# EasyEDA Pro project 贴片练习PCB.epro, board PCB1
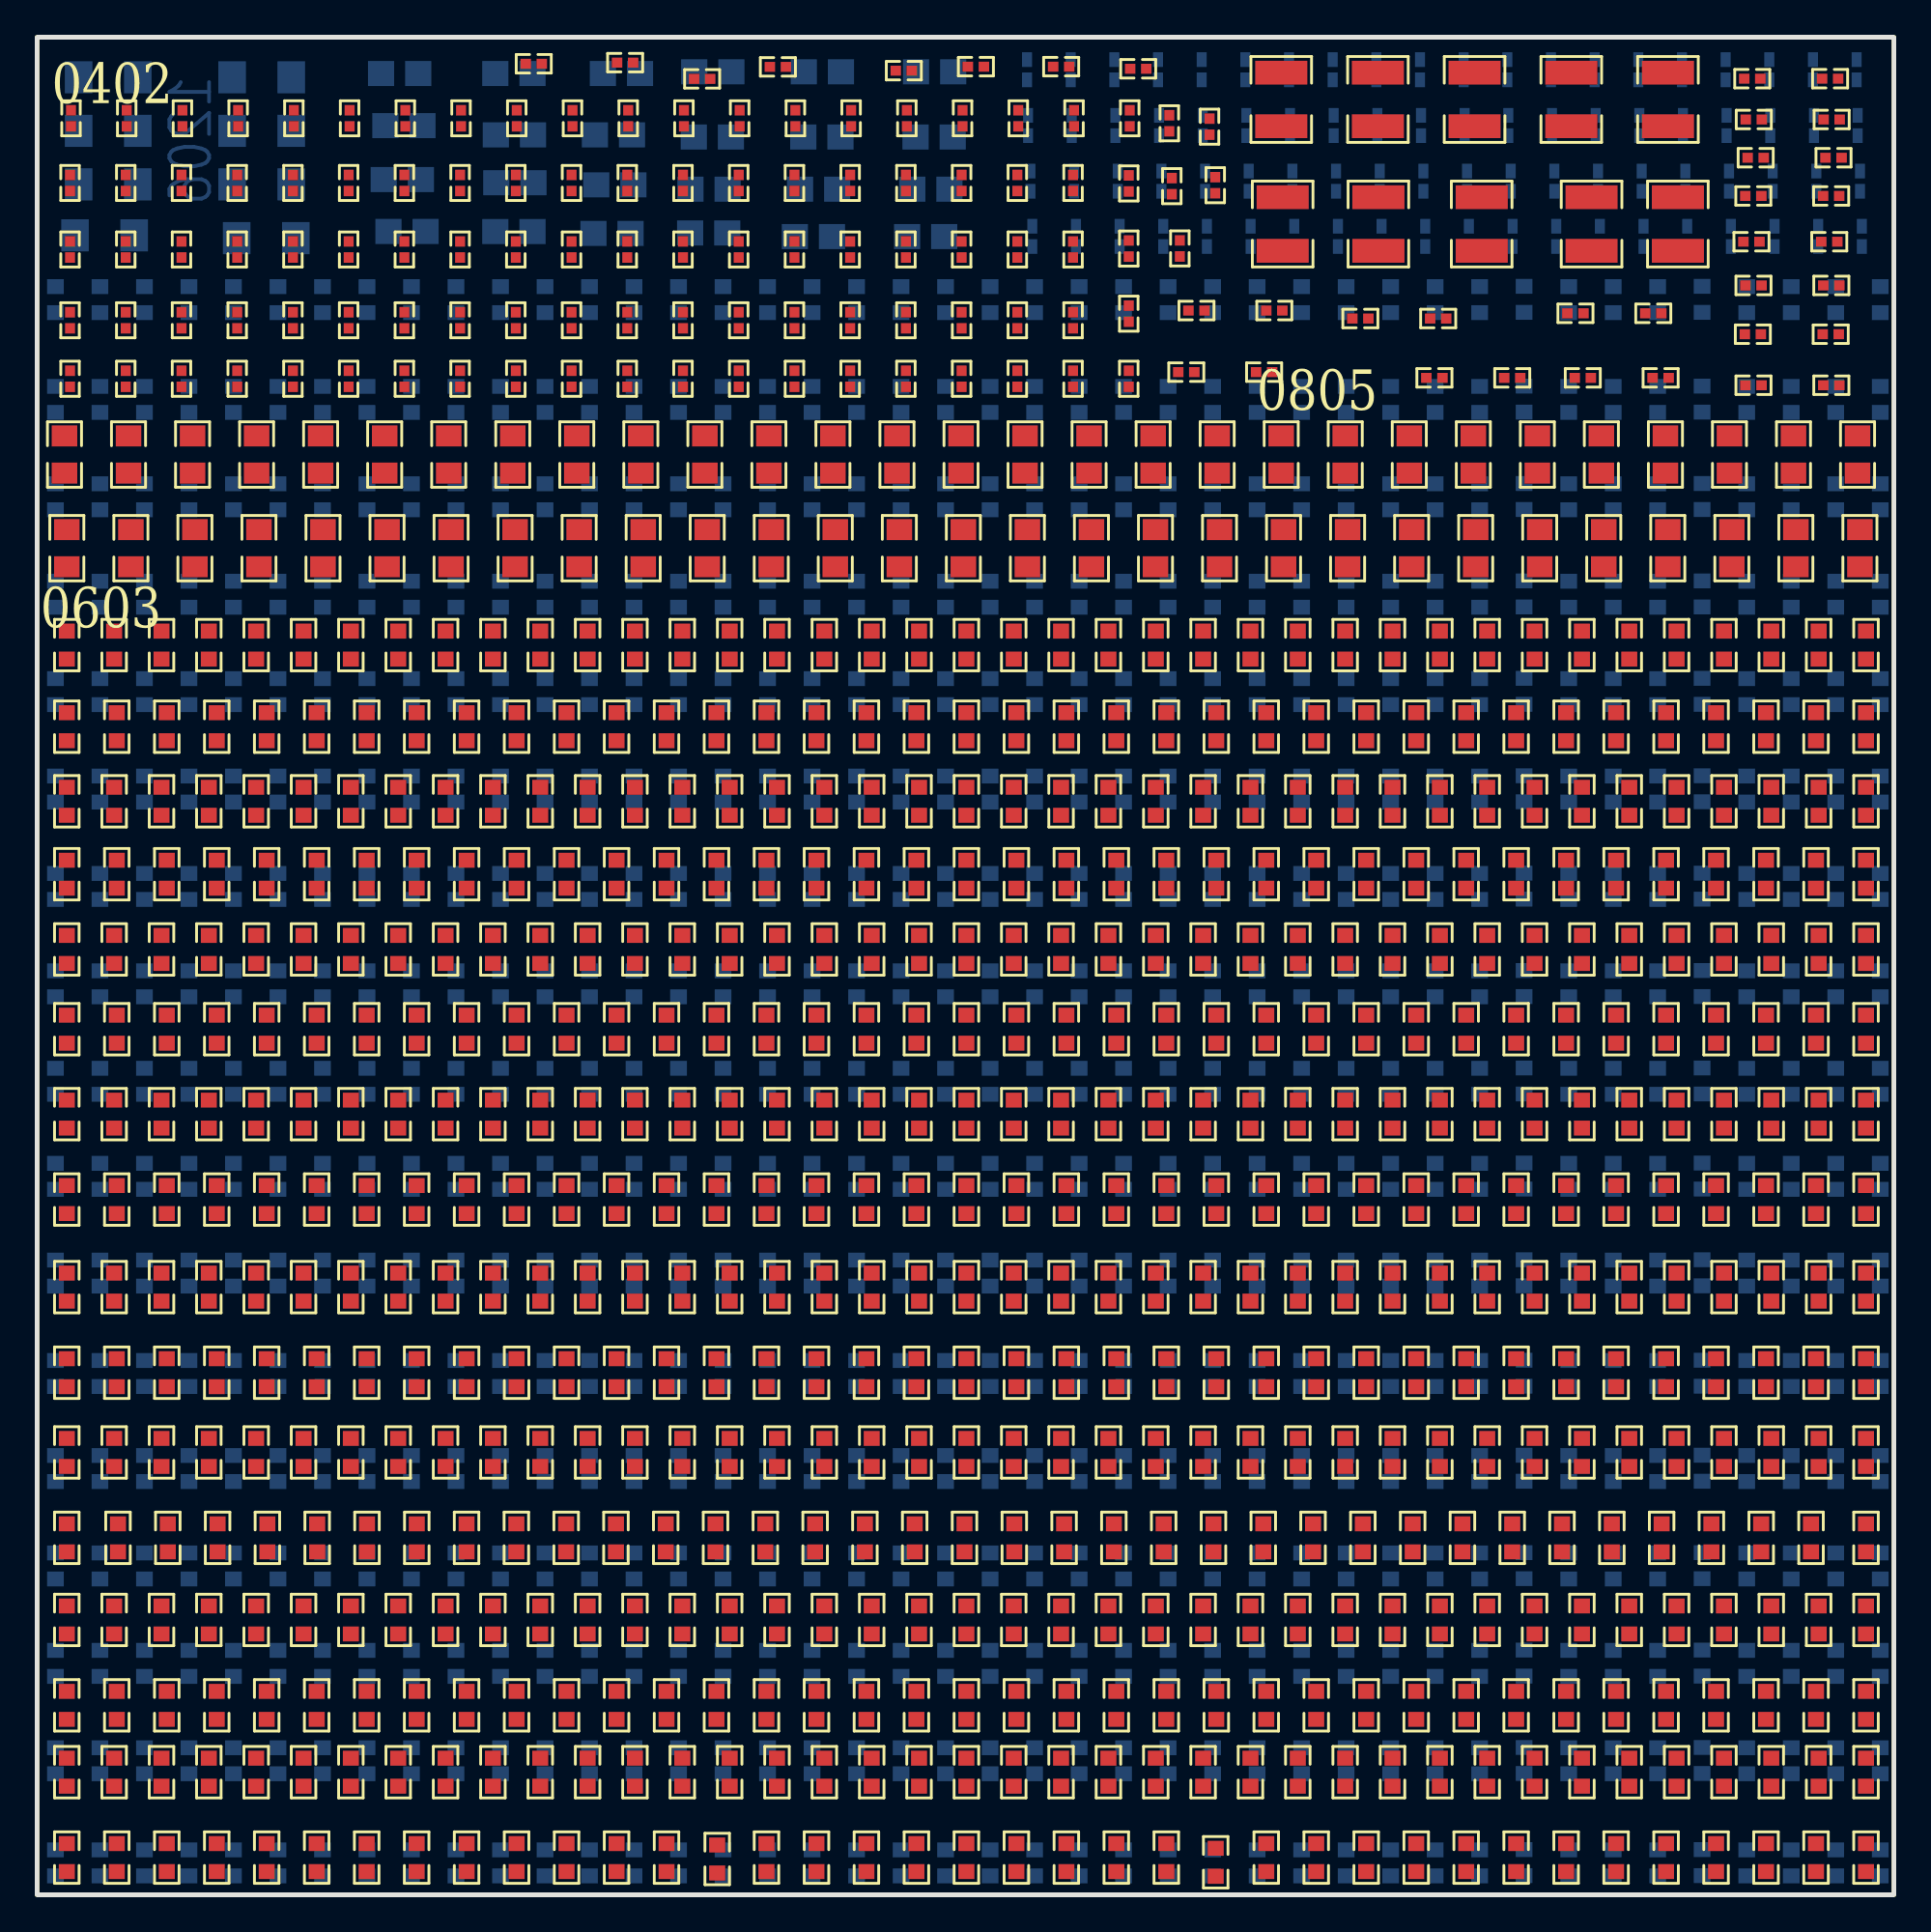
[diagram p3: board, top side]
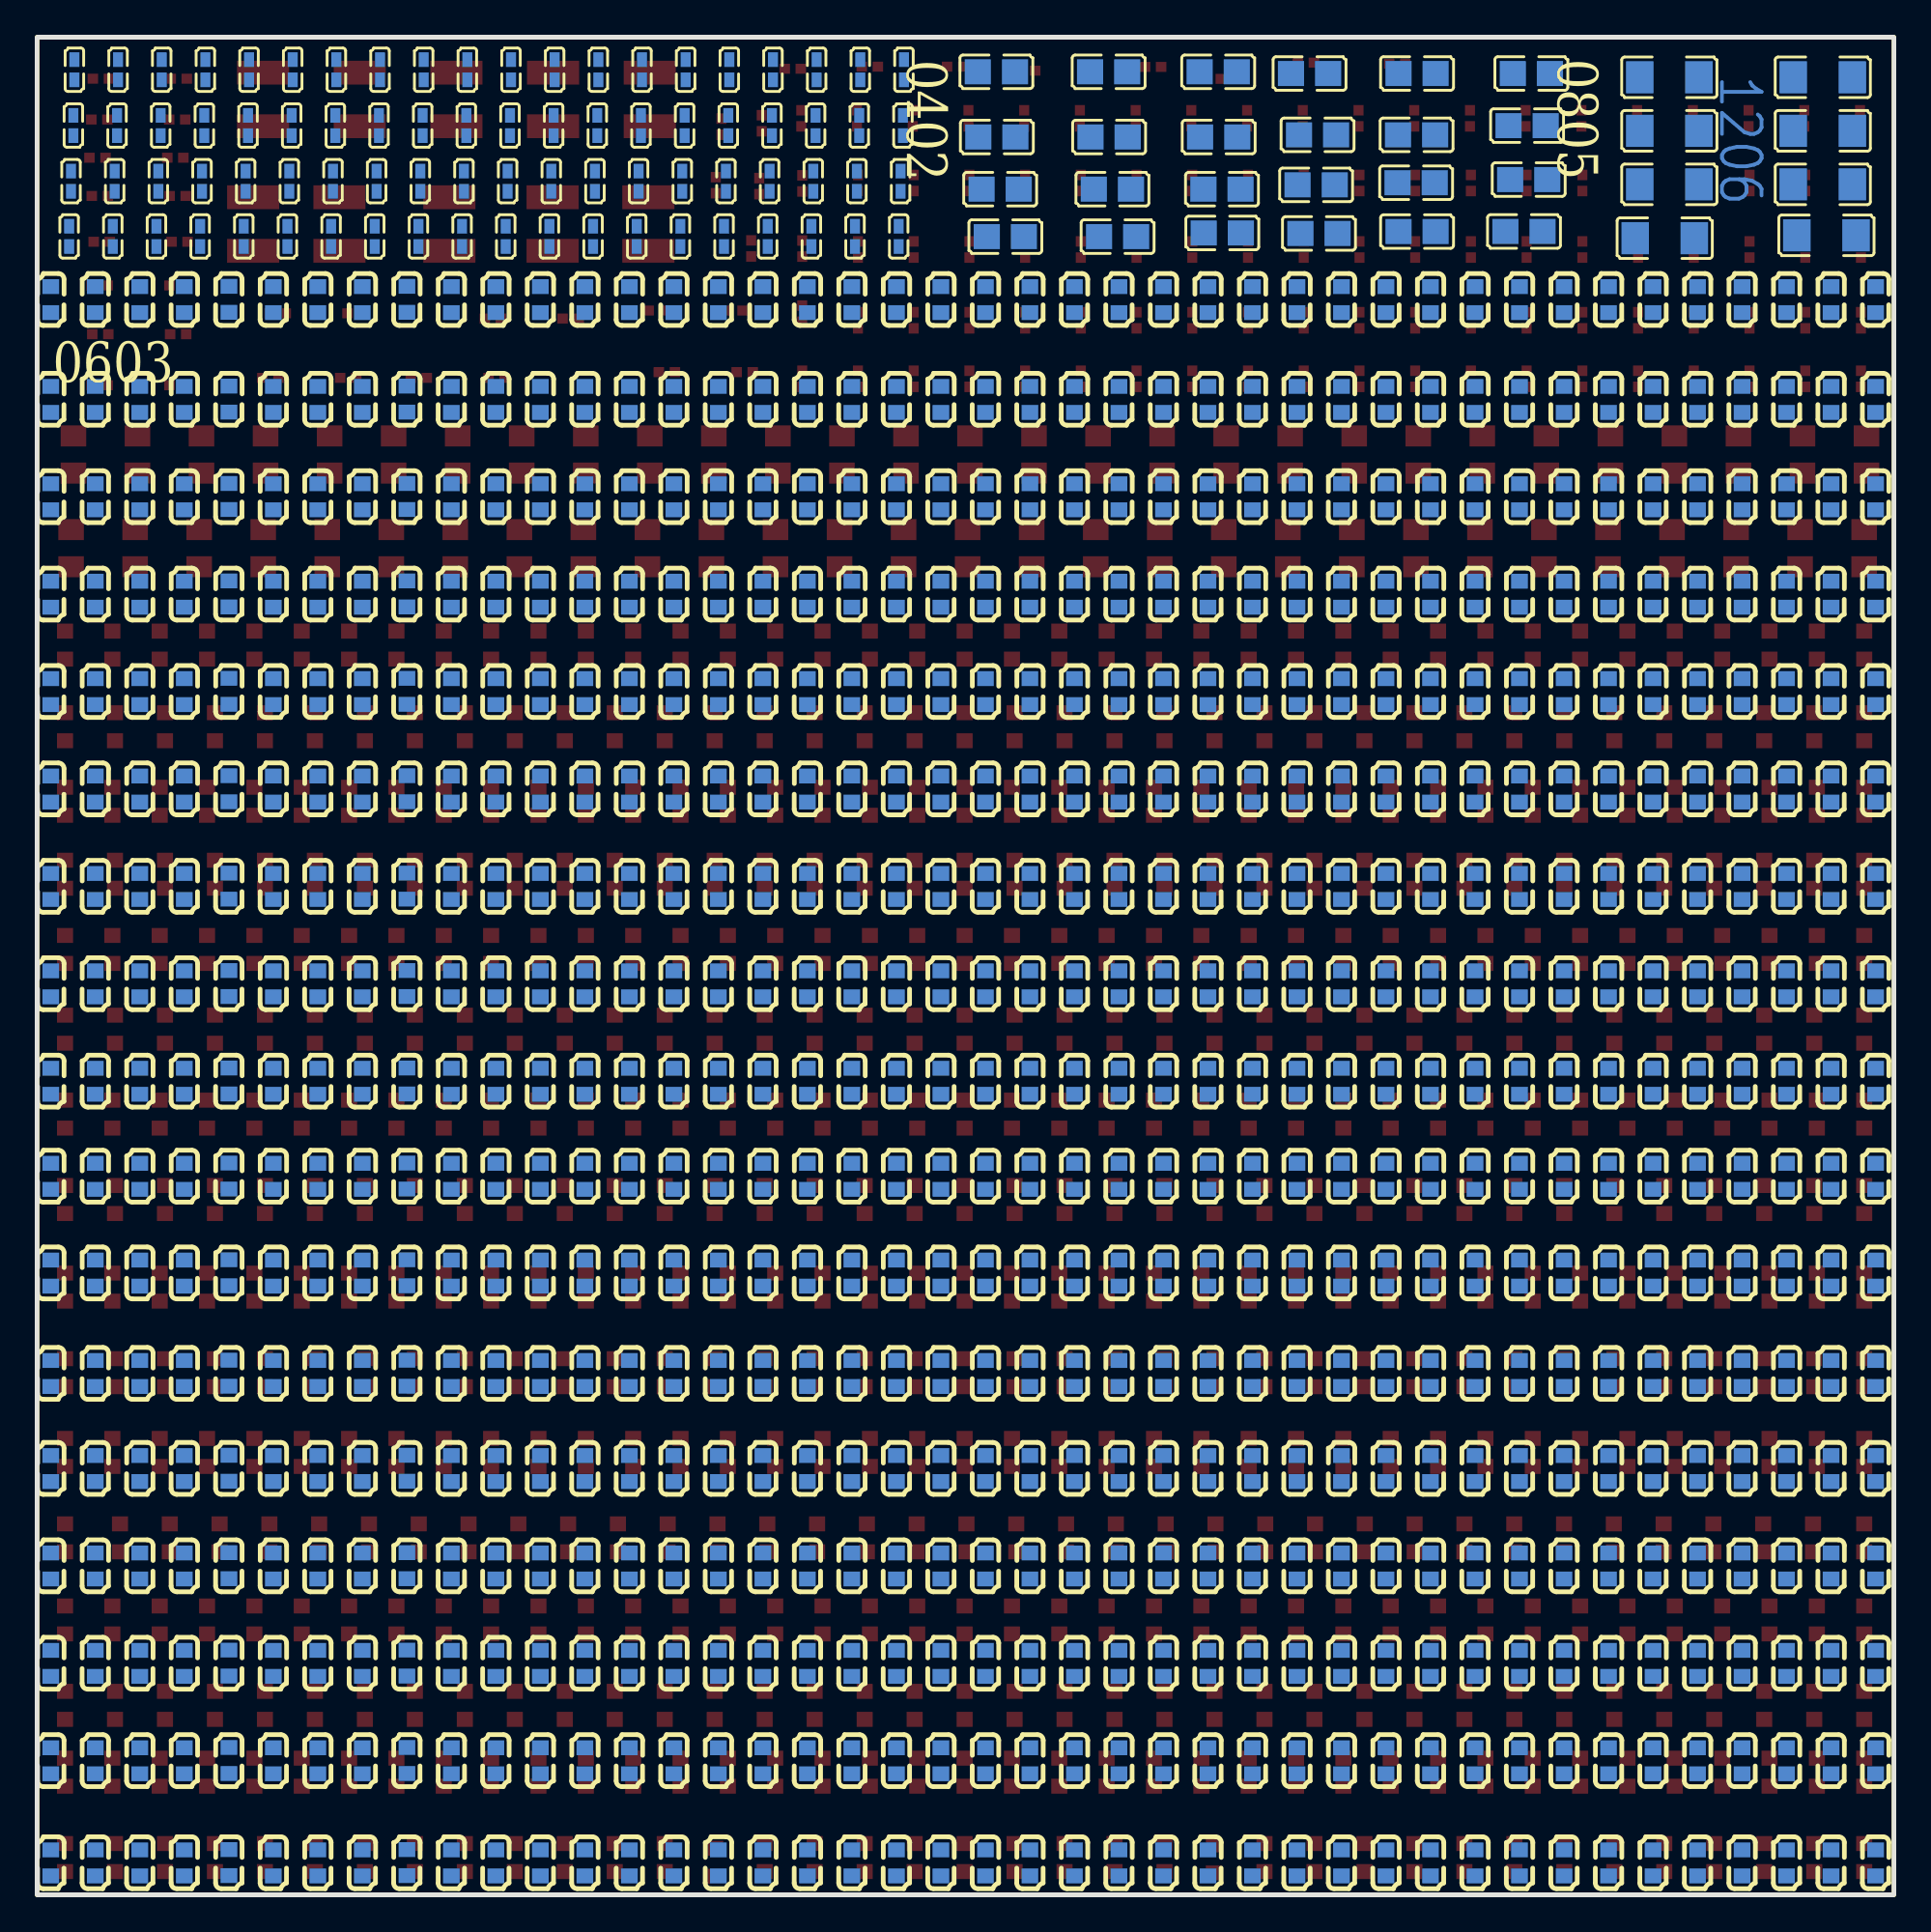
[diagram p4: board, bottom side, seen from below]

Outline 100 x 100 mm; copper layers: Top Layer, Bottom Layer. Coordinates in mm from the lower left corner of the outline.
Outline path: rectangle 0,100 100,0
Stack: Top Layer 0.035mm / Dielectric1 1.51mm FR4 er 4.5 / Bottom Layer 0.035mm

## Design rules (mm)
template: JLCPCB Capability(Two Layers Board)
spacing copperThickness1oz (default): track to track 0.102, other pairs 0.152 to 0.3
spacing copperThickness2oz: track to track 0.203, other pairs 0.152 to 0.3
track width copperThickness1oz (default): min 0.127, default 0.254, max 2.54
track width copperThickness2oz: min 0.203, default 0.254, max 2.54
differential pair differentialPair (default): width min 0.127, default 0.254, max 2.54; gap min 0.152, default 0.152
via viaSize (default): diameter min 0.5, default 0.61, max 10; hole min 0.3, default 0.305, max 6.3

## Placement (name value [footprint] x y rotation side)
C1  -  [C0603]  99.27 85.87 270 bottom
C1#2  -  [C0603]  99.27 80.5 270 bottom
C1#3  -  [C0603]  99.27 75.26 270 bottom
C1#4  -  [C0603]  99.27 70.01 270 bottom
C1#5  -  [C0603]  99.27 64.77 270 bottom
C1#6  -  [C0603]  99.27 59.53 270 bottom
C1#7  -  [C0603]  99.27 54.28 270 bottom
C1#8  -  [C0603]  99.27 49.04 270 bottom
C1#9  -  [C0603]  99.27 43.8 270 bottom
C1#10  -  [C0603]  99.27 38.68 270 bottom
C1#11  -  [C0603]  99.27 33.47 270 bottom
C1#12  -  [C0603]  99.27 28.06 270 bottom
C1#13  -  [C0603]  99.27 22.95 270 bottom
C1#14  -  [C0603]  99.27 17.7 270 bottom
C1#15  -  [C0603]  99.27 12.46 270 bottom
C1#16  -  [C0603]  99.27 7.22 270 bottom
C1#17  -  [C0603]  99.27 1.72 270 bottom
C2  -  [C0603]  10.57 85.87 270 bottom
C2#2  -  [C0603]  10.57 80.5 270 bottom
C2#3  -  [C0603]  10.57 75.26 270 bottom
C2#4  -  [C0603]  10.57 70.01 270 bottom
C2#5  -  [C0603]  10.57 64.77 270 bottom
C2#6  -  [C0603]  10.57 59.53 270 bottom
C2#7  -  [C0603]  10.57 54.28 270 bottom
C2#8  -  [C0603]  10.57 49.04 270 bottom
C2#9  -  [C0603]  10.57 43.8 270 bottom
C2#10  -  [C0603]  10.57 38.68 270 bottom
C2#11  -  [C0603]  10.57 33.47 270 bottom
C2#12  -  [C0603]  10.57 28.06 270 bottom
C2#13  -  [C0603]  10.57 22.95 270 bottom
C2#14  -  [C0603]  10.57 17.7 270 bottom
C2#15  -  [C0603]  10.57 12.46 270 bottom
C2#16  -  [C0603]  10.57 7.22 270 bottom
C2#17  -  [C0603]  10.57 1.72 270 bottom
C3  -  [C0603]  32.15 85.87 270 bottom
C3#2  -  [C0603]  32.15 80.5 270 bottom
C3#3  -  [C0603]  32.15 75.26 270 bottom
C3#4  -  [C0603]  32.15 70.01 270 bottom
C3#5  -  [C0603]  32.15 64.77 270 bottom
C3#6  -  [C0603]  32.15 59.53 270 bottom
C3#7  -  [C0603]  32.15 54.28 270 bottom
C3#8  -  [C0603]  32.15 49.04 270 bottom
C3#9  -  [C0603]  32.15 43.8 270 bottom
C3#10  -  [C0603]  32.15 38.68 270 bottom
C3#11  -  [C0603]  32.15 33.47 270 bottom
C3#12  -  [C0603]  32.15 28.06 270 bottom
C3#13  -  [C0603]  32.15 22.95 270 bottom
C3#14  -  [C0603]  32.15 17.7 270 bottom
C3#15  -  [C0603]  32.15 12.46 270 bottom
C3#16  -  [C0603]  32.15 7.22 270 bottom
C3#17  -  [C0603]  32.15 1.72 270 bottom
C4  -  [C0603]  58.52 49.04 270 bottom
C4#2  -  [C0603]  58.52 85.87 270 bottom
C4#3  -  [C0603]  58.52 80.5 270 bottom
C4#4  -  [C0603]  58.52 75.26 270 bottom
C4#5  -  [C0603]  58.52 70.01 270 bottom
C4#6  -  [C0603]  58.52 64.77 270 bottom
C4#7  -  [C0603]  58.52 59.53 270 bottom
C4#8  -  [C0603]  58.52 54.28 270 bottom
C4#9  -  [C0603]  58.52 43.8 270 bottom
C4#10  -  [C0603]  58.52 38.68 270 bottom
C4#11  -  [C0603]  58.52 33.47 270 bottom
C4#12  -  [C0603]  58.52 28.06 270 bottom
C4#13  -  [C0603]  58.52 22.95 270 bottom
C4#14  -  [C0603]  58.52 17.7 270 bottom
C4#15  -  [C0603]  58.52 12.46 270 bottom
C4#16  -  [C0603]  58.52 7.22 270 bottom
C4#17  -  [C0603]  58.52 1.72 270 bottom
C5  -  [C0603]  8.18 85.87 270 bottom
C5#2  -  [C0603]  8.18 80.5 270 bottom
C5#3  -  [C0603]  8.18 75.26 270 bottom
C5#4  -  [C0603]  8.18 70.01 270 bottom
C5#5  -  [C0603]  8.18 64.77 270 bottom
C5#6  -  [C0603]  8.18 59.53 270 bottom
C5#7  -  [C0603]  8.18 54.28 270 bottom
C5#8  -  [C0603]  8.18 49.04 270 bottom
C5#9  -  [C0603]  8.18 43.8 270 bottom
C5#10  -  [C0603]  8.18 38.68 270 bottom
C5#11  -  [C0603]  8.18 33.47 270 bottom
C5#12  -  [C0603]  8.18 28.06 270 bottom
C5#13  -  [C0603]  8.18 22.95 270 bottom
C5#14  -  [C0603]  8.18 17.7 270 bottom
C5#15  -  [C0603]  8.18 12.46 270 bottom
C5#16  -  [C0603]  8.18 7.22 270 bottom
C5#17  -  [C0603]  8.18 1.72 270 bottom
C6  -  [C0603]  17.77 85.87 270 bottom
C6#2  -  [C0603]  20.16 85.87 270 bottom
C6#3  -  [C0603]  39.34 85.87 270 bottom
C6#4  -  [C0603]  39.34 80.5 270 bottom
C6#5  -  [C0603]  17.77 80.5 270 bottom
C6#6  -  [C0603]  20.16 80.5 270 bottom
C6#7  -  [C0603]  39.34 75.26 270 bottom
C6#8  -  [C0603]  17.77 75.26 270 bottom
C6#9  -  [C0603]  20.16 75.26 270 bottom
C6#10  -  [C0603]  39.34 70.01 270 bottom
C6#11  -  [C0603]  17.77 70.01 270 bottom
C6#12  -  [C0603]  20.16 70.01 270 bottom
C6#13  -  [C0603]  39.34 64.77 270 bottom
C6#14  -  [C0603]  17.77 64.77 270 bottom
C6#15  -  [C0603]  20.16 64.77 270 bottom
C6#16  -  [C0603]  39.34 59.53 270 bottom
C6#17  -  [C0603]  17.77 59.53 270 bottom
C6#18  -  [C0603]  20.16 59.53 270 bottom
C6#19  -  [C0603]  39.34 54.28 270 bottom
C6#20  -  [C0603]  17.77 54.28 270 bottom
C6#21  -  [C0603]  20.16 54.28 270 bottom
C6#22  -  [C0603]  39.34 49.04 270 bottom
C6#23  -  [C0603]  17.77 49.04 270 bottom
C6#24  -  [C0603]  20.16 49.04 270 bottom
C6#25  -  [C0603]  39.34 43.8 270 bottom
C6#26  -  [C0603]  17.77 43.8 270 bottom
C6#27  -  [C0603]  20.16 43.8 270 bottom
C6#28  -  [C0603]  39.34 38.68 270 bottom
C6#29  -  [C0603]  17.77 38.68 270 bottom
C6#30  -  [C0603]  20.16 38.68 270 bottom
C6#31  -  [C0603]  39.34 33.47 270 bottom
C6#32  -  [C0603]  17.77 33.47 270 bottom
C6#33  -  [C0603]  20.16 33.47 270 bottom
C6#34  -  [C0603]  39.34 28.06 270 bottom
C6#35  -  [C0603]  17.77 28.06 270 bottom
C6#36  -  [C0603]  20.16 28.06 270 bottom
C6#37  -  [C0603]  39.34 22.95 270 bottom
C6#38  -  [C0603]  17.77 22.95 270 bottom
C6#39  -  [C0603]  20.16 22.95 270 bottom
C6#40  -  [C0603]  39.34 17.7 270 bottom
C6#41  -  [C0603]  17.77 17.7 270 bottom
C6#42  -  [C0603]  20.16 17.7 270 bottom
C6#43  -  [C0603]  39.34 12.46 270 bottom
C6#44  -  [C0603]  17.77 12.46 270 bottom
C6#45  -  [C0603]  20.16 12.46 270 bottom
C6#46  -  [C0603]  39.34 7.22 270 bottom
C6#47  -  [C0603]  17.77 7.22 270 bottom
C6#48  -  [C0603]  20.16 7.22 270 bottom
C6#49  -  [C0603]  39.34 1.72 270 bottom
C6#50  -  [C0603]  17.77 1.72 270 bottom
C6#51  -  [C0603]  20.16 1.72 270 bottom
C7  -  [C0603]  24.96 85.87 270 bottom
C7#2  -  [C0603]  24.96 80.5 270 bottom
C7#3  -  [C0603]  24.96 75.26 270 bottom
C7#4  -  [C0603]  24.96 70.01 270 bottom
C7#5  -  [C0603]  24.96 64.77 270 bottom
C7#6  -  [C0603]  24.96 59.53 270 bottom
C7#7  -  [C0603]  24.96 54.28 270 bottom
C7#8  -  [C0603]  24.96 49.04 270 bottom
C7#9  -  [C0603]  24.96 43.8 270 bottom
C7#10  -  [C0603]  24.96 38.68 270 bottom
C7#11  -  [C0603]  24.96 33.47 270 bottom
C7#12  -  [C0603]  24.96 28.06 270 bottom
C7#13  -  [C0603]  24.96 22.95 270 bottom
C7#14  -  [C0603]  24.96 17.7 270 bottom
C7#15  -  [C0603]  24.96 12.46 270 bottom
C7#16  -  [C0603]  24.96 7.22 270 bottom
C7#17  -  [C0603]  24.96 1.72 270 bottom
C8  -  [C0603]  41.74 85.87 270 bottom
C8#2  -  [C0603]  41.74 80.5 270 bottom
C8#3  -  [C0603]  41.74 75.26 270 bottom
C8#4  -  [C0603]  41.74 70.01 270 bottom
C8#5  -  [C0603]  41.74 64.77 270 bottom
C8#6  -  [C0603]  41.74 59.53 270 bottom
C8#7  -  [C0603]  41.74 54.28 270 bottom
C8#8  -  [C0603]  41.74 49.04 270 bottom
C8#9  -  [C0603]  41.74 43.8 270 bottom
C8#10  -  [C0603]  41.74 38.68 270 bottom
C8#11  -  [C0603]  41.74 33.47 270 bottom
C8#12  -  [C0603]  41.74 28.06 270 bottom
C8#13  -  [C0603]  41.74 22.95 270 bottom
C8#14  -  [C0603]  41.74 17.7 270 bottom
C8#15  -  [C0603]  41.74 12.46 270 bottom
C8#16  -  [C0603]  41.74 7.22 270 bottom
C8#17  -  [C0603]  41.74 1.72 270 bottom
C9  -  [C0603]  77.69 85.87 270 bottom
C9#2  -  [C0603]  77.69 80.5 270 bottom
C9#3  -  [C0603]  77.69 75.26 270 bottom
C9#4  -  [C0603]  77.69 70.01 270 bottom
C9#5  -  [C0603]  77.69 64.77 270 bottom
C9#6  -  [C0603]  77.69 59.53 270 bottom
C9#7  -  [C0603]  77.69 54.28 270 bottom
C9#8  -  [C0603]  77.69 49.04 270 bottom
C9#9  -  [C0603]  77.69 43.8 270 bottom
C9#10  -  [C0603]  77.69 38.68 270 bottom
C9#11  -  [C0603]  77.69 33.47 270 bottom
C9#12  -  [C0603]  77.69 28.06 270 bottom
C9#13  -  [C0603]  77.69 22.95 270 bottom
C9#14  -  [C0603]  77.69 17.7 270 bottom
C9#15  -  [C0603]  77.69 12.46 270 bottom
C9#16  -  [C0603]  77.69 7.22 270 bottom
C9#17  -  [C0603]  77.69 1.72 270 bottom
C10  -  [C0603]  44.13 85.87 270 bottom
C10#2  -  [C0603]  44.13 80.5 270 bottom
C10#3  -  [C0603]  44.13 75.26 270 bottom
C10#4  -  [C0603]  44.13 70.01 270 bottom
C10#5  -  [C0603]  44.13 64.77 270 bottom
C10#6  -  [C0603]  44.13 59.53 270 bottom
C10#7  -  [C0603]  44.13 54.28 270 bottom
C10#8  -  [C0603]  44.13 49.04 270 bottom
C10#9  -  [C0603]  44.13 43.8 270 bottom
C10#10  -  [C0603]  44.13 38.68 270 bottom
C10#11  -  [C0603]  44.13 33.47 270 bottom
C10#12  -  [C0603]  44.13 28.06 270 bottom
C10#13  -  [C0603]  44.13 22.95 270 bottom
C10#14  -  [C0603]  44.13 17.7 270 bottom
C10#15  -  [C0603]  44.13 12.46 270 bottom
C10#16  -  [C0603]  44.13 7.22 270 bottom
C10#17  -  [C0603]  44.13 1.72 270 bottom
C11  -  [C0603]  65.71 85.87 270 bottom
C11#2  -  [C0603]  65.71 80.5 270 bottom
C11#3  -  [C0603]  65.71 75.26 270 bottom
C11#4  -  [C0603]  65.71 70.01 270 bottom
C11#5  -  [C0603]  65.71 64.77 270 bottom
C11#6  -  [C0603]  65.71 59.53 270 bottom
C11#7  -  [C0603]  65.71 54.28 270 bottom
C11#8  -  [C0603]  65.71 49.04 270 bottom
C11#9  -  [C0603]  65.71 43.8 270 bottom
C11#10  -  [C0603]  65.71 38.68 270 bottom
C11#11  -  [C0603]  65.71 33.47 270 bottom
C11#12  -  [C0603]  65.71 28.06 270 bottom
C11#13  -  [C0603]  65.71 22.95 270 bottom
C11#14  -  [C0603]  65.71 17.7 270 bottom
C11#15  -  [C0603]  65.71 12.46 270 bottom
C11#16  -  [C0603]  65.71 7.22 270 bottom
C11#17  -  [C0603]  65.71 1.72 270 bottom
C12  -  [C0603]  84.88 85.87 270 bottom
C12#2  -  [C0603]  84.88 80.5 270 bottom
C12#3  -  [C0603]  84.88 75.26 270 bottom
C12#4  -  [C0603]  84.88 70.01 270 bottom
C12#5  -  [C0603]  84.88 64.77 270 bottom
C12#6  -  [C0603]  84.88 59.53 270 bottom
C12#7  -  [C0603]  84.88 54.28 270 bottom
C12#8  -  [C0603]  84.88 49.04 270 bottom
C12#9  -  [C0603]  84.88 43.8 270 bottom
C12#10  -  [C0603]  84.88 38.68 270 bottom
C12#11  -  [C0603]  84.88 33.47 270 bottom
C12#12  -  [C0603]  84.88 28.06 270 bottom
C12#13  -  [C0603]  84.88 22.95 270 bottom
C12#14  -  [C0603]  84.88 17.7 270 bottom
C12#15  -  [C0603]  84.88 12.46 270 bottom
C12#16  -  [C0603]  84.88 7.22 270 bottom
C12#17  -  [C0603]  84.88 1.72 270 bottom
C13  -  [C0603]  94.47 85.87 270 bottom
C13#2  -  [C0603]  94.47 80.5 270 bottom
C13#3  -  [C0603]  94.47 75.26 270 bottom
C13#4  -  [C0603]  94.47 70.01 270 bottom
C13#5  -  [C0603]  94.47 64.77 270 bottom
C13#6  -  [C0603]  94.47 59.53 270 bottom
C13#7  -  [C0603]  94.47 54.28 270 bottom
C13#8  -  [C0603]  94.47 49.04 270 bottom
C13#9  -  [C0603]  94.47 43.8 270 bottom
C13#10  -  [C0603]  94.47 38.68 270 bottom
C13#11  -  [C0603]  94.47 33.47 270 bottom
C13#12  -  [C0603]  94.47 28.06 270 bottom
C13#13  -  [C0603]  94.47 22.95 270 bottom
C13#14  -  [C0603]  94.47 17.7 270 bottom
C13#15  -  [C0603]  94.47 12.46 270 bottom
C13#16  -  [C0603]  94.47 7.22 270 bottom
C13#17  -  [C0603]  94.47 1.72 270 bottom
C14  -  [C0603]  92.07 85.87 270 bottom
C14#2  -  [C0603]  92.07 80.5 270 bottom
C14#3  -  [C0603]  92.07 75.26 270 bottom
C14#4  -  [C0603]  92.07 70.01 270 bottom
C14#5  -  [C0603]  92.07 64.77 270 bottom
C14#6  -  [C0603]  92.07 59.53 270 bottom
C14#7  -  [C0603]  92.07 54.28 270 bottom
C14#8  -  [C0603]  92.07 49.04 270 bottom
C14#9  -  [C0603]  92.07 43.8 270 bottom
C14#10  -  [C0603]  92.07 38.68 270 bottom
C14#11  -  [C0603]  92.07 33.47 270 bottom
C14#12  -  [C0603]  92.07 28.06 270 bottom
C14#13  -  [C0603]  92.07 22.95 270 bottom
C14#14  -  [C0603]  92.07 17.7 270 bottom
C14#15  -  [C0603]  92.07 12.46 270 bottom
C14#16  -  [C0603]  92.07 7.22 270 bottom
C14#17  -  [C0603]  92.07 1.72 270 bottom
C15  -  [C0603]  75.3 85.87 270 bottom
C15#2  -  [C0603]  75.3 80.5 270 bottom
C15#3  -  [C0603]  75.3 75.26 270 bottom
C15#4  -  [C0603]  75.3 70.01 270 bottom
C15#5  -  [C0603]  75.3 64.77 270 bottom
C15#6  -  [C0603]  75.3 59.53 270 bottom
C15#7  -  [C0603]  75.3 54.28 270 bottom
C15#8  -  [C0603]  75.3 49.04 270 bottom
C15#9  -  [C0603]  75.3 43.8 270 bottom
C15#10  -  [C0603]  75.3 38.68 270 bottom
C15#11  -  [C0603]  75.3 33.47 270 bottom
C15#12  -  [C0603]  75.3 28.06 270 bottom
C15#13  -  [C0603]  75.3 22.95 270 bottom
C15#14  -  [C0603]  75.3 17.7 270 bottom
C15#15  -  [C0603]  75.3 12.46 270 bottom
C15#16  -  [C0603]  75.3 7.22 270 bottom
C15#17  -  [C0603]  75.3 1.72 270 bottom
C16  -  [C0603]  63.31 85.87 270 bottom
C16#2  -  [C0603]  63.31 80.5 270 bottom
C16#3  -  [C0603]  63.31 75.26 270 bottom
C16#4  -  [C0603]  63.31 70.01 270 bottom
C16#5  -  [C0603]  63.31 64.77 270 bottom
C16#6  -  [C0603]  63.31 59.53 270 bottom
C16#7  -  [C0603]  63.31 54.28 270 bottom
C16#8  -  [C0603]  63.31 49.04 270 bottom
C16#9  -  [C0603]  63.31 43.8 270 bottom
C16#10  -  [C0603]  63.31 38.68 270 bottom
C16#11  -  [C0603]  63.31 33.47 270 bottom
C16#12  -  [C0603]  63.31 28.06 270 bottom
C16#13  -  [C0603]  63.31 22.95 270 bottom
C16#14  -  [C0603]  63.31 17.7 270 bottom
C16#15  -  [C0603]  63.31 12.46 270 bottom
C16#16  -  [C0603]  63.31 7.22 270 bottom
C16#17  -  [C0603]  63.31 1.72 270 bottom
C17  -  [C0603]  56.12 85.87 270 bottom
C17#2  -  [C0603]  56.12 80.5 270 bottom
C17#3  -  [C0603]  56.12 75.26 270 bottom
C17#4  -  [C0603]  56.12 70.01 270 bottom
C17#5  -  [C0603]  56.12 64.77 270 bottom
C17#6  -  [C0603]  56.12 59.53 270 bottom
C17#7  -  [C0603]  56.12 54.28 270 bottom
C17#8  -  [C0603]  56.12 49.04 270 bottom
C17#9  -  [C0603]  56.12 43.8 270 bottom
C17#10  -  [C0603]  56.12 38.68 270 bottom
C17#11  -  [C0603]  56.12 33.47 270 bottom
C17#12  -  [C0603]  56.12 28.06 270 bottom
C17#13  -  [C0603]  56.12 22.95 270 bottom
C17#14  -  [C0603]  56.12 17.7 270 bottom
C17#15  -  [C0603]  56.12 12.46 270 bottom
C17#16  -  [C0603]  56.12 7.22 270 bottom
C17#17  -  [C0603]  56.12 1.72 270 bottom
C18  -  [C0603]  34.54 85.87 270 bottom
C18#2  -  [C0603]  34.54 80.5 270 bottom
C18#3  -  [C0603]  34.54 75.26 270 bottom
C18#4  -  [C0603]  34.54 70.01 270 bottom
C18#5  -  [C0603]  34.54 64.77 270 bottom
C18#6  -  [C0603]  34.54 59.53 270 bottom
C18#7  -  [C0603]  34.54 54.28 270 bottom
C18#8  -  [C0603]  34.54 49.04 270 bottom
C18#9  -  [C0603]  34.54 43.8 270 bottom
C18#10  -  [C0603]  34.54 38.68 270 bottom
C18#11  -  [C0603]  34.54 33.47 270 bottom
C18#12  -  [C0603]  34.54 28.06 270 bottom
C18#13  -  [C0603]  34.54 22.95 270 bottom
C18#14  -  [C0603]  34.54 17.7 270 bottom
C18#15  -  [C0603]  34.54 12.46 270 bottom
C18#16  -  [C0603]  34.54 7.22 270 bottom
C18#17  -  [C0603]  34.54 1.72 270 bottom
C19  -  [C0603]  87.28 85.87 270 bottom
C19#2  -  [C0603]  87.28 80.5 270 bottom
C19#3  -  [C0603]  87.28 75.26 270 bottom
C19#4  -  [C0603]  87.28 70.01 270 bottom
C19#5  -  [C0603]  87.28 64.77 270 bottom
C19#6  -  [C0603]  87.28 59.53 270 bottom
C19#7  -  [C0603]  87.28 54.28 270 bottom
C19#8  -  [C0603]  87.28 49.04 270 bottom
C19#9  -  [C0603]  87.28 43.8 270 bottom
C19#10  -  [C0603]  87.28 38.68 270 bottom
C19#11  -  [C0603]  87.28 33.47 270 bottom
C19#12  -  [C0603]  87.28 28.06 270 bottom
C19#13  -  [C0603]  87.28 22.95 270 bottom
C19#14  -  [C0603]  87.28 17.7 270 bottom
C19#15  -  [C0603]  87.28 12.46 270 bottom
C19#16  -  [C0603]  87.28 7.22 270 bottom
C19#17  -  [C0603]  87.28 1.72 270 bottom
C20  -  [C0603]  68.1 85.87 270 bottom
C20#2  -  [C0603]  68.1 80.5 270 bottom
C20#3  -  [C0603]  68.1 75.26 270 bottom
C20#4  -  [C0603]  68.1 70.01 270 bottom
C20#5  -  [C0603]  68.1 64.77 270 bottom
C20#6  -  [C0603]  68.1 59.53 270 bottom
C20#7  -  [C0603]  68.1 54.28 270 bottom
C20#8  -  [C0603]  68.1 49.04 270 bottom
C20#9  -  [C0603]  68.1 43.8 270 bottom
C20#10  -  [C0603]  68.1 38.68 270 bottom
C20#11  -  [C0603]  68.1 33.47 270 bottom
C20#12  -  [C0603]  68.1 28.06 270 bottom
C20#13  -  [C0603]  68.1 22.95 270 bottom
C20#14  -  [C0603]  68.1 17.7 270 bottom
C20#15  -  [C0603]  68.1 12.46 270 bottom
C20#16  -  [C0603]  68.1 7.22 270 bottom
C20#17  -  [C0603]  68.1 1.72 270 bottom
C21  -  [C0603]  48.93 38.68 270 bottom
C21#2  -  [C0603]  48.93 33.47 270 bottom
C21#3  -  [C0603]  48.93 85.87 270 bottom
C21#4  -  [C0603]  48.93 80.5 270 bottom
C21#5  -  [C0603]  48.93 75.26 270 bottom
C21#6  -  [C0603]  48.93 70.01 270 bottom
C21#7  -  [C0603]  48.93 64.77 270 bottom
C21#8  -  [C0603]  48.93 59.53 270 bottom
C21#9  -  [C0603]  48.93 54.28 270 bottom
C21#10  -  [C0603]  48.93 49.04 270 bottom
C21#11  -  [C0603]  48.93 43.8 270 bottom
C21#12  -  [C0603]  48.93 28.06 270 bottom
C21#13  -  [C0603]  48.93 22.95 270 bottom
C21#14  -  [C0603]  48.93 17.7 270 bottom
C21#15  -  [C0603]  48.93 12.46 270 bottom
C21#16  -  [C0603]  48.93 7.22 270 bottom
C21#17  -  [C0603]  48.93 1.72 270 bottom
C22  -  [C0603]  29.75 85.87 270 bottom
C22#2  -  [C0603]  29.75 80.5 270 bottom
C22#3  -  [C0603]  29.75 75.26 270 bottom
C22#4  -  [C0603]  29.75 70.01 270 bottom
C22#5  -  [C0603]  29.75 64.77 270 bottom
C22#6  -  [C0603]  29.75 59.53 270 bottom
C22#7  -  [C0603]  29.75 54.28 270 bottom
C22#8  -  [C0603]  29.75 49.04 270 bottom
C22#9  -  [C0603]  29.75 43.8 270 bottom
C22#10  -  [C0603]  29.75 38.68 270 bottom
C22#11  -  [C0603]  29.75 33.47 270 bottom
C22#12  -  [C0603]  29.75 28.06 270 bottom
C22#13  -  [C0603]  29.75 22.95 270 bottom
C22#14  -  [C0603]  29.75 17.7 270 bottom
C22#15  -  [C0603]  29.75 12.46 270 bottom
C22#16  -  [C0603]  29.75 7.22 270 bottom
C22#17  -  [C0603]  29.75 1.72 270 bottom
C23  -  [C0603]  22.56 85.87 270 bottom
C23#2  -  [C0603]  22.56 80.5 270 bottom
C23#3  -  [C0603]  22.56 75.26 270 bottom
C23#4  -  [C0603]  22.56 70.01 270 bottom
C23#5  -  [C0603]  22.56 64.77 270 bottom
C23#6  -  [C0603]  22.56 59.53 270 bottom
C23#7  -  [C0603]  22.56 54.28 270 bottom
C23#8  -  [C0603]  22.56 49.04 270 bottom
C23#9  -  [C0603]  22.56 43.8 270 bottom
C23#10  -  [C0603]  22.56 38.68 270 bottom
C23#11  -  [C0603]  22.56 33.47 270 bottom
C23#12  -  [C0603]  22.56 28.06 270 bottom
C23#13  -  [C0603]  22.56 22.95 270 bottom
C23#14  -  [C0603]  22.56 17.7 270 bottom
C23#15  -  [C0603]  22.56 12.46 270 bottom
C23#16  -  [C0603]  22.56 7.22 270 bottom
C23#17  -  [C0603]  22.56 1.72 270 bottom
C24  -  [C0603]  12.97 85.87 270 bottom
C24#2  -  [C0603]  12.97 80.5 270 bottom
C24#3  -  [C0603]  12.97 75.26 270 bottom
C24#4  -  [C0603]  12.97 70.01 270 bottom
C24#5  -  [C0603]  12.97 64.77 270 bottom
C24#6  -  [C0603]  12.97 59.53 270 bottom
C24#7  -  [C0603]  12.97 54.28 270 bottom
C24#8  -  [C0603]  12.97 49.04 270 bottom
C24#9  -  [C0603]  12.97 43.8 270 bottom
C24#10  -  [C0603]  12.97 38.68 270 bottom
C24#11  -  [C0603]  12.97 33.47 270 bottom
C24#12  -  [C0603]  12.97 28.06 270 bottom
C24#13  -  [C0603]  12.97 22.95 270 bottom
C24#14  -  [C0603]  12.97 17.7 270 bottom
C24#15  -  [C0603]  12.97 12.46 270 bottom
C24#16  -  [C0603]  12.97 7.22 270 bottom
C24#17  -  [C0603]  12.97 1.72 270 bottom
C25  -  [C0603]  70.5 85.87 270 bottom
C25#2  -  [C0603]  70.5 80.5 270 bottom
C25#3  -  [C0603]  70.5 75.26 270 bottom
C25#4  -  [C0603]  70.5 70.01 270 bottom
C25#5  -  [C0603]  70.5 64.77 270 bottom
C25#6  -  [C0603]  70.5 59.53 270 bottom
C25#7  -  [C0603]  70.5 54.28 270 bottom
C25#8  -  [C0603]  70.5 49.04 270 bottom
C25#9  -  [C0603]  70.5 43.8 270 bottom
C25#10  -  [C0603]  70.5 38.68 270 bottom
C25#11  -  [C0603]  70.5 33.47 270 bottom
C25#12  -  [C0603]  70.5 28.06 270 bottom
C25#13  -  [C0603]  70.5 22.95 270 bottom
C25#14  -  [C0603]  70.5 17.7 270 bottom
C25#15  -  [C0603]  70.5 12.46 270 bottom
C25#16  -  [C0603]  70.5 7.22 270 bottom
C25#17  -  [C0603]  70.5 1.72 270 bottom
C26  -  [C0603]  51.32 85.87 270 bottom
C26#2  -  [C0603]  51.32 80.5 270 bottom
C26#3  -  [C0603]  51.32 75.26 270 bottom
C26#4  -  [C0603]  51.32 70.01 270 bottom
C26#5  -  [C0603]  51.32 64.77 270 bottom
C26#6  -  [C0603]  51.32 59.53 270 bottom
C26#7  -  [C0603]  51.32 54.28 270 bottom
C26#8  -  [C0603]  51.32 49.04 270 bottom
C26#9  -  [C0603]  51.32 43.8 270 bottom
C26#10  -  [C0603]  51.32 38.68 270 bottom
C26#11  -  [C0603]  51.32 33.47 270 bottom
C26#12  -  [C0603]  51.32 28.06 270 bottom
C26#13  -  [C0603]  51.32 22.95 270 bottom
C26#14  -  [C0603]  51.32 17.7 270 bottom
C26#15  -  [C0603]  51.32 12.46 270 bottom
C26#16  -  [C0603]  51.32 7.22 270 bottom
C26#17  -  [C0603]  51.32 1.72 270 bottom
C27  -  [C0603]  36.94 85.87 270 bottom
C27#2  -  [C0603]  36.94 80.5 270 bottom
C27#3  -  [C0603]  36.94 75.26 270 bottom
C27#4  -  [C0603]  36.94 70.01 270 bottom
C27#5  -  [C0603]  36.94 64.77 270 bottom
C27#6  -  [C0603]  36.94 59.53 270 bottom
C27#7  -  [C0603]  36.94 54.28 270 bottom
C27#8  -  [C0603]  36.94 49.04 270 bottom
C27#9  -  [C0603]  36.94 43.8 270 bottom
C27#10  -  [C0603]  36.94 38.68 270 bottom
C27#11  -  [C0603]  36.94 33.47 270 bottom
C27#12  -  [C0603]  36.94 28.06 270 bottom
C27#13  -  [C0603]  36.94 22.95 270 bottom
C27#14  -  [C0603]  36.94 17.7 270 bottom
C27#15  -  [C0603]  36.94 12.46 270 bottom
C27#16  -  [C0603]  36.94 7.22 270 bottom
C27#17  -  [C0603]  36.94 1.72 270 bottom
C28  -  [C0603]  5.78 85.87 270 bottom
C28#2  -  [C0603]  5.78 80.5 270 bottom
C28#3  -  [C0603]  5.78 75.26 270 bottom
C28#4  -  [C0603]  5.78 70.01 270 bottom
C28#5  -  [C0603]  5.78 64.77 270 bottom
C28#6  -  [C0603]  5.78 59.53 270 bottom
C28#7  -  [C0603]  5.78 54.28 270 bottom
C28#8  -  [C0603]  5.78 49.04 270 bottom
C28#9  -  [C0603]  5.78 43.8 270 bottom
C28#10  -  [C0603]  5.78 38.68 270 bottom
C28#11  -  [C0603]  5.78 33.47 270 bottom
C28#12  -  [C0603]  5.78 28.06 270 bottom
C28#13  -  [C0603]  5.78 22.95 270 bottom
C28#14  -  [C0603]  5.78 17.7 270 bottom
C28#15  -  [C0603]  5.78 12.46 270 bottom
C28#16  -  [C0603]  5.78 7.22 270 bottom
C28#17  -  [C0603]  5.78 1.72 270 bottom
C29  -  [C0603]  0.99 85.87 270 bottom
C29#2  -  [C0603]  0.99 80.5 270 bottom
C29#3  -  [C0603]  0.99 75.26 270 bottom
C29#4  -  [C0603]  0.99 70.01 270 bottom
C29#5  -  [C0603]  0.99 64.77 270 bottom
C29#6  -  [C0603]  0.99 59.53 270 bottom
C29#7  -  [C0603]  0.99 54.28 270 bottom
C29#8  -  [C0603]  0.99 49.04 270 bottom
C29#9  -  [C0603]  0.99 43.8 270 bottom
C29#10  -  [C0603]  0.99 38.68 270 bottom
C29#11  -  [C0603]  0.99 33.47 270 bottom
C29#12  -  [C0603]  0.99 28.06 270 bottom
C29#13  -  [C0603]  0.99 22.95 270 bottom
C29#14  -  [C0603]  0.99 17.7 270 bottom
C29#15  -  [C0603]  0.99 12.46 270 bottom
C29#16  -  [C0603]  0.99 7.22 270 bottom
C29#17  -  [C0603]  0.99 1.72 270 bottom
C30  -  [C0603]  3.38 85.87 270 bottom
C30#2  -  [C0603]  3.38 80.5 270 bottom
C30#3  -  [C0603]  3.38 75.26 270 bottom
C30#4  -  [C0603]  3.38 70.01 270 bottom
C30#5  -  [C0603]  3.38 64.77 270 bottom
C30#6  -  [C0603]  3.38 59.53 270 bottom
C30#7  -  [C0603]  3.38 54.28 270 bottom
C30#8  -  [C0603]  3.38 49.04 270 bottom
C30#9  -  [C0603]  3.38 43.8 270 bottom
C30#10  -  [C0603]  3.38 38.68 270 bottom
C30#11  -  [C0603]  3.38 33.47 270 bottom
C30#12  -  [C0603]  3.38 28.06 270 bottom
C30#13  -  [C0603]  3.38 22.95 270 bottom
C30#14  -  [C0603]  3.38 17.7 270 bottom
C30#15  -  [C0603]  3.38 12.46 270 bottom
C30#16  -  [C0603]  3.38 7.22 270 bottom
C30#17  -  [C0603]  3.38 1.72 270 bottom
C31  -  [C0603]  15.37 85.87 270 bottom
C31#2  -  [C0603]  15.37 80.5 270 bottom
C31#3  -  [C0603]  15.37 75.26 270 bottom
C31#4  -  [C0603]  15.37 70.01 270 bottom
C31#5  -  [C0603]  15.37 64.77 270 bottom
C31#6  -  [C0603]  15.37 59.53 270 bottom
C31#7  -  [C0603]  15.37 54.28 270 bottom
C31#8  -  [C0603]  15.37 49.04 270 bottom
C31#9  -  [C0603]  15.37 43.8 270 bottom
C31#10  -  [C0603]  15.37 38.68 270 bottom
C31#11  -  [C0603]  15.37 33.47 270 bottom
C31#12  -  [C0603]  15.37 28.06 270 bottom
C31#13  -  [C0603]  15.37 22.95 270 bottom
C31#14  -  [C0603]  15.37 17.7 270 bottom
C31#15  -  [C0603]  15.37 12.46 270 bottom
C31#16  -  [C0603]  15.37 7.22 270 bottom
C31#17  -  [C0603]  15.37 1.72 270 bottom
C32  -  [C0603]  46.53 33.47 270 bottom
C32#2  -  [C0603]  46.53 85.87 270 bottom
C32#3  -  [C0603]  46.53 80.5 270 bottom
C32#4  -  [C0603]  46.53 75.26 270 bottom
C32#5  -  [C0603]  46.53 70.01 270 bottom
C32#6  -  [C0603]  46.53 64.77 270 bottom
C32#7  -  [C0603]  46.53 59.53 270 bottom
C32#8  -  [C0603]  46.53 54.28 270 bottom
C32#9  -  [C0603]  46.53 49.04 270 bottom
C32#10  -  [C0603]  46.53 43.8 270 bottom
C32#11  -  [C0603]  46.53 38.68 270 bottom
C32#12  -  [C0603]  46.53 28.06 270 bottom
C32#13  -  [C0603]  46.53 22.95 270 bottom
C32#14  -  [C0603]  46.53 17.7 270 bottom
C32#15  -  [C0603]  46.53 12.46 270 bottom
C32#16  -  [C0603]  46.53 7.22 270 bottom
C32#17  -  [C0603]  46.53 1.72 270 bottom
C33  -  [C0603]  82.49 85.87 270 bottom
C33#2  -  [C0603]  82.49 80.5 270 bottom
C33#3  -  [C0603]  82.49 75.26 270 bottom
C33#4  -  [C0603]  82.49 70.01 270 bottom
C33#5  -  [C0603]  82.49 64.77 270 bottom
C33#6  -  [C0603]  82.49 59.53 270 bottom
C33#7  -  [C0603]  82.49 54.28 270 bottom
C33#8  -  [C0603]  82.49 49.04 270 bottom
C33#9  -  [C0603]  82.49 43.8 270 bottom
C33#10  -  [C0603]  82.49 38.68 270 bottom
C33#11  -  [C0603]  82.49 33.47 270 bottom
C33#12  -  [C0603]  82.49 28.06 270 bottom
C33#13  -  [C0603]  82.49 22.95 270 bottom
C33#14  -  [C0603]  82.49 17.7 270 bottom
C33#15  -  [C0603]  82.49 12.46 270 bottom
C33#16  -  [C0603]  82.49 7.22 270 bottom
C33#17  -  [C0603]  82.49 1.72 270 bottom
C34  -  [C0603]  27.35 85.87 270 bottom
C34#2  -  [C0603]  27.35 80.5 270 bottom
C34#3  -  [C0603]  27.35 75.26 270 bottom
C34#4  -  [C0603]  27.35 70.01 270 bottom
C34#5  -  [C0603]  27.35 64.77 270 bottom
C34#6  -  [C0603]  27.35 59.53 270 bottom
C34#7  -  [C0603]  27.35 54.28 270 bottom
C34#8  -  [C0603]  27.35 49.04 270 bottom
C34#9  -  [C0603]  27.35 43.8 270 bottom
C34#10  -  [C0603]  27.35 38.68 270 bottom
C34#11  -  [C0603]  27.35 33.47 270 bottom
C34#12  -  [C0603]  27.35 28.06 270 bottom
C34#13  -  [C0603]  27.35 22.95 270 bottom
C34#14  -  [C0603]  27.35 17.7 270 bottom
C34#15  -  [C0603]  27.35 12.46 270 bottom
C34#16  -  [C0603]  27.35 7.22 270 bottom
C34#17  -  [C0603]  27.35 1.72 270 bottom
C35  -  [C0603]  60.91 33.47 270 bottom
C35#2  -  [C0603]  60.91 85.87 270 bottom
C35#3  -  [C0603]  60.91 80.5 270 bottom
C35#4  -  [C0603]  60.91 75.26 270 bottom
C35#5  -  [C0603]  60.91 70.01 270 bottom
C35#6  -  [C0603]  60.91 64.77 270 bottom
C35#7  -  [C0603]  60.91 59.53 270 bottom
C35#8  -  [C0603]  60.91 54.28 270 bottom
C35#9  -  [C0603]  60.91 49.04 270 bottom
C35#10  -  [C0603]  60.91 43.8 270 bottom
C35#11  -  [C0603]  60.91 38.68 270 bottom
C35#12  -  [C0603]  60.91 28.06 270 bottom
C35#13  -  [C0603]  60.91 22.95 270 bottom
C35#14  -  [C0603]  60.91 17.7 270 bottom
C35#15  -  [C0603]  60.91 12.46 270 bottom
C35#16  -  [C0603]  60.91 7.22 270 bottom
C35#17  -  [C0603]  60.91 1.72 270 bottom
C36  -  [C0603]  53.72 85.87 270 bottom
C36#2  -  [C0603]  53.72 80.5 270 bottom
C36#3  -  [C0603]  53.72 75.26 270 bottom
C36#4  -  [C0603]  53.72 70.01 270 bottom
C36#5  -  [C0603]  53.72 64.77 270 bottom
C36#6  -  [C0603]  53.72 59.53 270 bottom
C36#7  -  [C0603]  53.72 54.28 270 bottom
C36#8  -  [C0603]  53.72 49.04 270 bottom
C36#9  -  [C0603]  53.72 43.8 270 bottom
C36#10  -  [C0603]  53.72 38.68 270 bottom
C36#11  -  [C0603]  53.72 33.47 270 bottom
C36#12  -  [C0603]  53.72 28.06 270 bottom
C36#13  -  [C0603]  53.72 22.95 270 bottom
C36#14  -  [C0603]  53.72 17.7 270 bottom
C36#15  -  [C0603]  53.72 12.46 270 bottom
C36#16  -  [C0603]  53.72 7.22 270 bottom
C36#17  -  [C0603]  53.72 1.72 270 bottom
C37  -  [C0603]  72.9 85.87 270 bottom
C37#2  -  [C0603]  72.9 80.5 270 bottom
C37#3  -  [C0603]  72.9 75.26 270 bottom
C37#4  -  [C0603]  72.9 70.01 270 bottom
C37#5  -  [C0603]  72.9 64.77 270 bottom
C37#6  -  [C0603]  72.9 59.53 270 bottom
C37#7  -  [C0603]  72.9 54.28 270 bottom
C37#8  -  [C0603]  72.9 49.04 270 bottom
C37#9  -  [C0603]  72.9 43.8 270 bottom
C37#10  -  [C0603]  72.9 38.68 270 bottom
C37#11  -  [C0603]  72.9 33.47 270 bottom
C37#12  -  [C0603]  72.9 28.06 270 bottom
C37#13  -  [C0603]  72.9 22.95 270 bottom
C37#14  -  [C0603]  72.9 17.7 270 bottom
C37#15  -  [C0603]  72.9 12.46 270 bottom
C37#16  -  [C0603]  72.9 7.22 270 bottom
C37#17  -  [C0603]  72.9 1.72 270 bottom
C38  -  [C0603]  96.87 85.87 270 bottom
C38#2  -  [C0603]  96.87 80.5 270 bottom
C38#3  -  [C0603]  96.87 75.26 270 bottom
C38#4  -  [C0603]  96.87 70.01 270 bottom
C38#5  -  [C0603]  96.87 64.77 270 bottom
C38#6  -  [C0603]  96.87 59.53 270 bottom
C38#7  -  [C0603]  96.87 54.28 270 bottom
C38#8  -  [C0603]  96.87 49.04 270 bottom
C38#9  -  [C0603]  96.87 43.8 270 bottom
C38#10  -  [C0603]  96.87 38.68 270 bottom
C38#11  -  [C0603]  96.87 33.47 270 bottom
C38#12  -  [C0603]  96.87 28.06 270 bottom
C38#13  -  [C0603]  96.87 22.95 270 bottom
C38#14  -  [C0603]  96.87 17.7 270 bottom
C38#15  -  [C0603]  96.87 12.46 270 bottom
C38#16  -  [C0603]  96.87 7.22 270 bottom
C38#17  -  [C0603]  96.87 1.72 270 bottom
C39  -  [C0603]  89.67 85.89 90 bottom
C39#2  -  [C0603]  89.67 80.52 90 bottom
C39#3  -  [C0603]  89.67 75.27 90 bottom
C39#4  -  [C0603]  89.67 70.03 90 bottom
C39#5  -  [C0603]  89.67 64.78 90 bottom
C39#6  -  [C0603]  89.67 59.54 90 bottom
C39#7  -  [C0603]  89.67 54.3 90 bottom
C39#8  -  [C0603]  89.67 49.05 90 bottom
C39#9  -  [C0603]  89.67 43.81 90 bottom
C39#10  -  [C0603]  89.67 38.69 90 bottom
C39#11  -  [C0603]  89.67 33.48 90 bottom
C39#12  -  [C0603]  89.67 28.08 90 bottom
C39#13  -  [C0603]  89.67 22.96 90 bottom
C39#14  -  [C0603]  89.67 17.72 90 bottom
C39#15  -  [C0603]  89.67 12.48 90 bottom
C39#16  -  [C0603]  89.67 7.23 90 bottom
C39#17  -  [C0603]  89.67 1.73 90 bottom
C40  -  [C0603]  80.08 85.89 90 bottom
C40#2  -  [C0603]  80.08 80.52 90 bottom
C40#3  -  [C0603]  80.08 75.27 90 bottom
C40#4  -  [C0603]  80.08 70.03 90 bottom
C40#5  -  [C0603]  80.08 64.78 90 bottom
C40#6  -  [C0603]  80.08 59.54 90 bottom
C40#7  -  [C0603]  80.08 54.3 90 bottom
C40#8  -  [C0603]  80.08 49.05 90 bottom
C40#9  -  [C0603]  80.08 43.81 90 bottom
C40#10  -  [C0603]  80.08 38.69 90 bottom
C40#11  -  [C0603]  80.08 33.48 90 bottom
C40#12  -  [C0603]  80.08 28.08 90 bottom
C40#13  -  [C0603]  80.08 22.96 90 bottom
C40#14  -  [C0603]  80.08 17.72 90 bottom
C40#15  -  [C0603]  80.08 12.48 90 bottom
C40#16  -  [C0603]  80.08 7.23 90 bottom
C40#17  -  [C0603]  80.08 1.73 90 bottom
C41  -  [C0402]  53.31 98.25 270 bottom
C41#2  -  [C0402]  53.37 95.24 270 bottom
C41#3  -  [C0402]  53.5 92.25 270 bottom
C41#4  -  [C0402]  53.6 89.28 270 bottom
C42  -  [C0402]  58.02 98.25 270 bottom
C42#2  -  [C0402]  58.07 95.24 270 bottom
C42#3  -  [C0402]  58.2 92.25 270 bottom
C42#4  -  [C0402]  58.3 89.28 270 bottom
C43  -  [C0402]  62.72 98.25 270 bottom
C43#2  -  [C0402]  62.78 95.24 270 bottom
C43#3  -  [C0402]  62.9 92.25 270 bottom
C43#4  -  [C0402]  63 89.28 270 bottom
C44  -  [C0402]  65.07 98.25 270 bottom
C44#2  -  [C0402]  65.13 95.24 270 bottom
C44#3  -  [C0402]  65.25 92.25 270 bottom
C44#4  -  [C0402]  65.36 89.28 270 bottom
C45  -  [C0402]  72.13 98.25 270 bottom
C45#2  -  [C0402]  72.18 95.24 270 bottom
C45#3  -  [C0402]  72.31 92.25 270 bottom
C45#4  -  [C0402]  72.41 89.28 270 bottom
C46  -  [C0402]  81.53 98.25 270 bottom
C46#2  -  [C0402]  81.59 95.24 270 bottom
C46#3  -  [C0402]  81.71 92.25 270 bottom
C46#4  -  [C0402]  81.82 89.28 270 bottom
C47  -  [C0402]  86.24 98.25 270 bottom
C47#2  -  [C0402]  86.29 95.24 270 bottom
C47#3  -  [C0402]  86.42 92.25 270 bottom
C47#4  -  [C0402]  86.52 89.28 270 bottom
C48  -  [C0402]  76.83 98.25 270 bottom
C48#2  -  [C0402]  76.88 95.24 270 bottom
C48#3  -  [C0402]  77.01 92.25 270 bottom
C48#4  -  [C0402]  77.11 89.28 270 bottom
C49  -  [C0402]  74.48 98.25 270 bottom
C49#2  -  [C0402]  74.53 95.24 270 bottom
C49#3  -  [C0402]  74.66 92.25 270 bottom
C49#4  -  [C0402]  74.76 89.28 270 bottom
C50  -  [C0402]  67.42 98.25 270 bottom
C50#2  -  [C0402]  67.48 95.24 270 bottom
C50#3  -  [C0402]  67.61 92.25 270 bottom
C50#4  -  [C0402]  67.71 89.28 270 bottom
C51  -  [C0402]  60.37 98.25 270 bottom
C51#2  -  [C0402]  60.42 95.24 270 bottom
C51#3  -  [C0402]  60.55 92.25 270 bottom
C51#4  -  [C0402]  60.65 89.28 270 bottom
C52  -  [C0402]  55.67 98.25 270 bottom
C52#2  -  [C0402]  55.72 95.24 270 bottom
C52#3  -  [C0402]  55.85 92.25 270 bottom
C52#4  -  [C0402]  55.95 89.28 270 bottom
C53  -  [C0402]  90.94 98.25 270 bottom
C53#2  -  [C0402]  90.99 95.24 270 bottom
C53#3  -  [C0402]  91.12 92.25 270 bottom
C53#4  -  [C0402]  91.22 89.28 270 bottom
C54  -  [C0402]  88.59 98.25 270 bottom
C54#2  -  [C0402]  88.64 95.24 270 bottom
C54#3  -  [C0402]  88.77 92.25 270 bottom
C54#4  -  [C0402]  88.87 89.28 270 bottom
C55  -  [C0402]  83.88 98.25 270 bottom
C55#2  -  [C0402]  83.94 95.24 270 bottom
C55#3  -  [C0402]  84.07 92.25 270 bottom
C55#4  -  [C0402]  84.17 89.28 270 bottom
C56  -  [C0402]  93.29 98.25 270 bottom
C56#2  -  [C0402]  93.34 95.24 270 bottom
C56#3  -  [C0402]  93.47 92.25 270 bottom
C56#4  -  [C0402]  93.57 89.28 270 bottom
C57  -  [C0402]  69.77 98.25 270 bottom
C57#2  -  [C0402]  69.83 95.24 270 bottom
C57#3  -  [C0402]  69.96 92.25 270 bottom
C57#4  -  [C0402]  70.06 89.28 270 bottom
C58  -  [C0402]  79.18 98.25 270 bottom
C58#2  -  [C0402]  79.24 95.24 270 bottom
C58#3  -  [C0402]  79.36 92.25 270 bottom
C58#4  -  [C0402]  79.46 89.28 270 bottom
C59  -  [C0402]  95.64 98.25 270 bottom
C59#2  -  [C0402]  95.7 95.24 270 bottom
C59#3  -  [C0402]  95.82 92.25 270 bottom
C59#4  -  [C0402]  95.92 89.28 270 bottom
C60  -  [C0402]  97.99 98.25 270 bottom
C60#2  -  [C0402]  98.05 95.24 270 bottom
C60#3  -  [C0402]  98.17 92.25 270 bottom
C60#4  -  [C0402]  98.28 89.28 270 bottom
C61  100nF  [C0805]  31.04 94.74 180 bottom
C62  100nF  [C0805]  31.11 92.05 0 bottom
C63  100nF  [C0805]  48.31 94.63 180 bottom
C64  100nF  [C0805]  42.09 91.82 180 bottom
C65  100nF  [C0805]  42.29 98.13 0 bottom
C66  100nF  [C0805]  36.19 91.82 180 bottom
C67  100nF  [C0805]  19.52 98.04 180 bottom
C68  100nF  [C0805]  36.17 89.46 180 bottom
C69  100nF  [C0805]  31.47 98.04 180 bottom
C70  100nF  [C0805]  30.96 89.43 0 bottom
C71  -  [C0805]  25.73 92.16 180 bottom
C71#2  -  [C0805]  25.68 89.53 180 bottom
C71#3  -  [C0805]  19.75 95.24 180 bottom
C71#4  -  [C0805]  19.67 92.33 180 bottom
C71#5  -  [C0805]  19.92 89.54 180 bottom
C72  100nF  [C0805]  25.7 94.74 180 bottom
C73  100nF  [C0805]  41.81 89.26 180 bottom
C74  100nF  [C0805]  25.68 98.04 0 bottom
C75  100nF  [C0805]  42.27 94.63 0 bottom
C76  100nF  [C0805]  36.39 98.13 180 bottom
C77  100nF  [C0805]  36.36 94.63 180 bottom
C78  100nF  [C0805]  47.85 89.26 180 bottom
C79  100nF  [C0805]  48.34 98.13 180 bottom
C80  100nF  [C0805]  48.13 91.82 180 bottom
C81  -  [C1206]  12.34 89.18 180 bottom
C81#2  -  [C1206]  3.83 92.08 180 bottom
C82  100nF  [C1206]  12.09 97.84 180 bottom
C83  100nF  [C1206]  12.09 94.96 180 bottom
C84  100nF  [C1206]  12.09 92.08 180 bottom
C85  100nF  [C1206]  3.83 97.84 180 bottom
C86  100nF  [C1206]  3.83 94.96 180 bottom
C88  100nF  [C1206]  3.63 89.33 180 bottom
R1  -  [R0603]  32.2 6.6 90 top
R1#2  -  [R0603]  32.2 14.8 90 top
R1#3  -  [R0603]  32.2 23.81 90 top
R1#4  -  [R0603]  32.2 32.72 90 top
R1#5  -  [R0603]  32.2 42.03 90 top
R1#6  -  [R0603]  32.2 50.89 90 top
R1#7  -  [R0603]  32.2 58.87 90 top
R1#8  -  [R0603]  32.2 67.27 90 top
R2  -  [R0603]  34.75 14.8 90 top
R2#2  -  [R0603]  34.75 23.81 90 top
R2#3  -  [R0603]  34.75 32.72 90 top
R2#4  -  [R0603]  34.75 6.6 90 top
R2#5  -  [R0603]  34.75 42.03 90 top
R2#6  -  [R0603]  34.75 50.89 90 top
R2#7  -  [R0603]  34.75 58.87 90 top
R2#8  -  [R0603]  34.75 67.27 90 top
R6  -  [R1210]  83.72 89.94 270 top
R6#2  -  [R1210]  88.37 89.94 270 top
R7  -  [R0402]  46.84 95.63 90 top
R7#2  -  [R0402]  46.79 92.15 90 top
R7#3  -  [R0402]  46.79 88.57 90 top
R7#4  -  [R0402]  46.79 84.76 90 top
R7#5  -  [R0402]  46.79 81.61 90 top
R8  -  [R0402]  52.79 92.15 90 top
R8#2  -  [R0402]  52.84 95.63 90 top
R8#3  -  [R0402]  52.79 88.57 90 top
R8#4  -  [R0402]  52.79 84.76 90 top
R8#5  -  [R0402]  52.79 81.61 90 top
R9  -  [R0805]  74.03 72.49 90 top
R9#2  -  [R0805]  25.74 72.49 90 top
R9#3  -  [R0805]  73.9 77.53 90 top
R9#4  -  [R0805]  25.62 77.53 90 top
R10  -  [R0603]  6.7 23.81 90 top
R10#2  -  [R0603]  6.7 32.72 90 top
R10#3  -  [R0603]  6.7 42.03 90 top
R10#4  -  [R0603]  6.7 50.89 90 top
R10#5  -  [R0603]  6.7 58.87 90 top
R10#6  -  [R0603]  6.7 67.27 90 top
R10#7  -  [R0603]  6.7 6.6 90 top
R10#8  -  [R0603]  6.7 14.8 90 top
R11  -  [R0603]  9.25 23.81 90 top
R11#2  -  [R0603]  9.25 32.72 90 top
R11#3  -  [R0603]  9.25 42.03 90 top
R11#4  -  [R0603]  9.25 50.89 90 top
R11#5  -  [R0603]  9.25 58.87 90 top
R11#6  -  [R0603]  9.25 67.27 90 top
R11#7  -  [R0603]  9.25 6.6 90 top
R11#8  -  [R0603]  9.25 14.8 90 top
R14  -  [R0603]  39.85 14.8 90 top
R14#2  -  [R0603]  39.85 23.81 90 top
R14#3  -  [R0603]  39.85 32.72 90 top
R14#4  -  [R0603]  39.85 42.03 90 top
R14#5  -  [R0603]  39.85 50.89 90 top
R14#6  -  [R0603]  39.85 58.87 90 top
R14#7  -  [R0603]  39.85 67.27 90 top
R14#8  -  [R0603]  39.85 6.6 90 top
R15  -  [R0603]  76.76 19.22 90 top
R15#2  -  [R0603]  76.96 28.11 90 top
R15#3  -  [R0603]  76.96 37.43 90 top
R15#4  -  [R0603]  76.96 46.6 90 top
R15#5  -  [R0603]  76.96 54.94 90 top
R15#6  -  [R0603]  76.96 62.88 90 top
R15#7  -  [R0603]  76.96 2.01 90 top
R15#8  -  [R0603]  76.96 10.2 90 top
R16  -  [R0603]  79.45 19.22 90 top
R16#2  -  [R0603]  79.66 28.11 90 top
R16#3  -  [R0603]  79.66 37.43 90 top
R16#4  -  [R0603]  79.66 46.6 90 top
R16#5  -  [R0603]  79.66 54.94 90 top
R16#6  -  [R0603]  79.66 62.88 90 top
R16#7  -  [R0603]  79.66 2.01 90 top
R16#8  -  [R0603]  79.66 10.2 90 top
R25  -  [R0603]  84.81 19.22 90 top
R25#2  -  [R0603]  85.04 28.11 90 top
R25#3  -  [R0603]  85.04 37.43 90 top
R25#4  -  [R0603]  85.04 46.6 90 top
R25#5  -  [R0603]  85.04 54.94 90 top
R25#6  -  [R0603]  85.04 62.88 90 top
R25#7  -  [R0603]  85.04 2.01 90 top
R25#8  -  [R0603]  85.04 10.2 90 top
R26  -  [R0603]  57.7 14.8 90 top
R26#2  -  [R0603]  57.7 23.81 90 top
R26#3  -  [R0603]  57.7 32.72 90 top
R26#4  -  [R0603]  57.7 42.03 90 top
R26#5  -  [R0603]  57.7 50.89 90 top
R26#6  -  [R0603]  57.7 58.87 90 top
R26#7  -  [R0603]  57.7 67.27 90 top
R26#8  -  [R0603]  57.7 6.6 90 top
R27  -  [R0603]  98.5 23.81 90 top
R27#2  -  [R0603]  98.5 32.72 90 top
R27#3  -  [R0603]  98.5 42.03 90 top
R27#4  -  [R0603]  98.5 50.89 90 top
R27#5  -  [R0603]  98.5 58.87 90 top
R27#6  -  [R0603]  98.5 67.27 90 top
R27#7  -  [R0603]  98.5 6.6 90 top
R27#8  -  [R0603]  98.5 14.8 90 top
R34  -  [R0603]  70.45 23.81 90 top
R34#2  -  [R0603]  70.45 32.72 90 top
R34#3  -  [R0603]  70.45 42.03 90 top
R34#4  -  [R0603]  70.45 50.89 90 top
R34#5  -  [R0603]  70.45 58.87 90 top
R34#6  -  [R0603]  70.45 67.27 90 top
R34#7  -  [R0603]  70.45 6.6 90 top
R34#8  -  [R0603]  70.45 14.8 90 top
R35  -  [R0603]  95.54 19.22 90 top
R35#2  -  [R0603]  95.81 28.11 90 top
R35#3  -  [R0603]  95.81 37.43 90 top
R35#4  -  [R0603]  95.81 46.6 90 top
R35#5  -  [R0603]  95.81 54.94 90 top
R35#6  -  [R0603]  95.81 62.88 90 top
R35#7  -  [R0603]  95.81 10.2 90 top
R35#8  -  [R0603]  95.81 2.01 90 top
R46  -  [R0603]  15.06 2.01 90 top
R46#2  -  [R0603]  15.08 19.22 90 top
R46#3  -  [R0603]  15.06 28.11 90 top
R46#4  -  [R0603]  15.06 37.43 90 top
R46#5  -  [R0603]  15.06 46.6 90 top
R46#6  -  [R0603]  15.06 54.94 90 top
R46#7  -  [R0603]  15.06 62.88 90 top
R46#8  -  [R0603]  15.06 10.2 90 top
R50  -  [R0603]  83.2 6.6 90 top
R50#2  -  [R0603]  83.2 23.81 90 top
R50#3  -  [R0603]  83.2 32.72 90 top
R50#4  -  [R0603]  83.2 42.03 90 top
R50#5  -  [R0603]  83.2 50.89 90 top
R50#6  -  [R0603]  83.2 58.87 90 top
R50#7  -  [R0603]  83.2 67.27 90 top
R50#8  -  [R0603]  83.2 14.8 90 top
R51  -  [R0603]  60.25 6.6 90 top
R51#2  -  [R0603]  60.25 23.81 90 top
R51#3  -  [R0603]  60.25 32.72 90 top
R51#4  -  [R0603]  60.25 42.03 90 top
R51#5  -  [R0603]  60.25 50.89 90 top
R51#6  -  [R0603]  60.25 58.87 90 top
R51#7  -  [R0603]  60.25 67.27 90 top
R51#8  -  [R0603]  60.25 14.8 90 top
R52  -  [R0603]  7.04 19.22 90 top
R52#2  -  [R0603]  6.98 2.01 90 top
R52#3  -  [R0603]  6.98 28.11 90 top
R52#4  -  [R0603]  6.98 37.43 90 top
R52#5  -  [R0603]  6.98 46.6 90 top
R52#6  -  [R0603]  6.98 54.94 90 top
R52#7  -  [R0603]  6.98 62.88 90 top
R52#8  -  [R0603]  6.98 10.2 90 top
R53  -  [R0603]  27.1 14.8 90 top
R53#2  -  [R0603]  27.1 6.6 90 top
R53#3  -  [R0603]  27.1 23.81 90 top
R53#4  -  [R0603]  27.1 32.72 90 top
R53#5  -  [R0603]  27.1 67.27 90 top
R53#6  -  [R0603]  27.1 42.03 90 top
R53#7  -  [R0603]  27.1 50.89 90 top
R53#8  -  [R0603]  27.1 58.87 90 top
R54  -  [R0603]  4.36 19.22 90 top
R54#2  -  [R0603]  4.29 2.01 90 top
R54#3  -  [R0603]  4.29 28.11 90 top
R54#4  -  [R0603]  4.29 37.43 90 top
R54#5  -  [R0603]  4.29 46.6 90 top
R54#6  -  [R0603]  4.29 54.94 90 top
R54#7  -  [R0603]  4.29 62.88 90 top
R54#8  -  [R0603]  4.29 10.2 90 top
R56  -  [R0603]  36.54 19.22 90 top
R56#2  -  [R0603]  36.63 1.93 90 top
R56#3  -  [R0603]  36.59 28.11 90 top
R56#4  -  [R0603]  36.59 37.43 90 top
R56#5  -  [R0603]  36.59 46.6 90 top
R56#6  -  [R0603]  36.59 54.94 90 top
R56#7  -  [R0603]  36.59 62.88 90 top
R56#8  -  [R0603]  36.59 10.2 90 top
R57  -  [R0603]  25.81 19.22 90 top
R57#2  -  [R0603]  25.82 2.01 90 top
R57#3  -  [R0603]  25.82 28.11 90 top
R57#4  -  [R0603]  25.82 37.43 90 top
R57#5  -  [R0603]  25.82 46.6 90 top
R57#6  -  [R0603]  25.82 54.94 90 top
R57#7  -  [R0603]  25.82 62.88 90 top
R57#8  -  [R0603]  25.82 10.2 90 top
R58  -  [R0603]  52.63 19.22 90 top
R58#2  -  [R0603]  52.74 2.01 90 top
R58#3  -  [R0603]  52.74 28.11 90 top
R58#4  -  [R0603]  52.74 37.43 90 top
R58#5  -  [R0603]  52.74 46.6 90 top
R58#6  -  [R0603]  52.74 54.94 90 top
R58#7  -  [R0603]  52.74 62.88 90 top
R58#8  -  [R0603]  52.74 10.2 90 top
R59  -  [R0603]  44.58 19.22 90 top
R59#2  -  [R0603]  44.66 2.01 90 top
R59#3  -  [R0603]  44.66 28.11 90 top
R59#4  -  [R0603]  44.66 37.43 90 top
R59#5  -  [R0603]  44.66 46.6 90 top
R59#6  -  [R0603]  44.66 54.94 90 top
R59#7  -  [R0603]  44.66 62.88 90 top
R59#8  -  [R0603]  44.66 10.2 90 top
R60  10K  [R1210]  77.8 89.94 270 top
R61  10K  [R1210]  77.42 96.65 90 top
R62  10K  [R1210]  87.83 96.65 90 top
R63  10K  [R1210]  72.24 89.94 90 top
R64  10K  [R1210]  67 96.65 90 top
R65  10K  [R1210]  72.21 96.65 90 top
R66  10K  [R1210]  67.08 89.94 90 top
R67  10K  [R1210]  82.63 96.65 90 top
R68  -  [R0402]  49.84 95.63 90 top
R68#2  -  [R0402]  49.79 92.15 90 top
R68#3  -  [R0402]  49.79 88.57 90 top
R68#4  -  [R0402]  49.79 84.76 90 top
R68#5  -  [R0402]  49.79 81.61 90 top
R69  -  [R0402]  92.33 88.99 180 top
R69#2  -  [R0402]  96.52 88.99 180 top
R69#3  -  [R0402]  92.44 86.63 180 top
R69#4  -  [R0402]  96.63 86.63 180 top
R69#5  -  [R0402]  92.4 84.01 180 top
R69#6  -  [R0402]  96.6 84.01 180 top
R69#7  -  [R0402]  92.44 81.26 180 top
R69#8  -  [R0402]  96.63 81.26 180 top
R69#9  -  [R0402]  62.44 85.28 180 top
R69#10  -  [R0402]  66.63 85.28 180 top
R69#11  -  [R0402]  66.08 81.97 180 top
R69#12  -  [R0402]  71.27 84.85 180 top
R69#13  -  [R0402]  75.46 84.85 180 top
R69#14  -  [R0402]  82.85 85.13 180 top
R69#15  -  [R0402]  43.84 95.63 90 top
R69#16  -  [R0402]  87.04 85.13 180 top
R69#17  -  [R0402]  83.25 81.66 180 top
R69#18  -  [R0402]  87.44 81.66 180 top
R69#19  -  [R0402]  75.25 81.66 180 top
R69#20  -  [R0402]  79.45 81.66 180 top
R69#21  -  [R0402]  61.89 81.97 180 top
R69#22  -  [R0402]  60.98 95.36 90 top
R69#23  -  [R0402]  61.11 91.98 90 top
R69#24  -  [R0402]  61.54 88.63 90 top
R69#25  -  [R0402]  43.79 92.15 90 top
R69#26  -  [R0402]  43.79 88.57 90 top
R69#27  -  [R0402]  63.14 95.18 90 top
R69#28  -  [R0402]  43.79 84.76 90 top
R69#29  -  [R0402]  43.79 81.61 90 top
R69#30  -  [R0402]  63.45 92.03 90 top
R69#31  -  [R0402]  55.15 98.41 180 top
R69#32  -  [R0402]  59.3 98.3 180 top
R69#33  -  [R0402]  50.56 98.41 180 top
R69#34  -  [R0402]  46.68 98.2 180 top
R69#35  -  [R0402]  39.9 98.4 180 top
R69#36  -  [R0402]  35.81 97.75 180 top
R69#37  -  [R0402]  31.67 98.63 180 top
R69#38  -  [R0402]  26.75 98.57 180 top
R69#39  -  [R0402]  92.37 97.77 180 top
R69#40  -  [R0402]  96.57 97.77 180 top
R69#41  -  [R0402]  92.46 95.57 180 top
R69#42  -  [R0402]  96.65 95.57 180 top
R69#43  -  [R0402]  92.56 93.51 180 top
R69#44  -  [R0402]  96.75 93.51 180 top
R69#45  -  [R0402]  92.43 91.45 180 top
R69#46  -  [R0402]  96.62 91.45 180 top
R70  -  [R0402]  40.84 95.63 90 top
R70#2  -  [R0402]  40.79 92.15 90 top
R70#3  -  [R0402]  40.79 88.57 90 top
R70#4  -  [R0402]  40.79 84.76 90 top
R70#5  -  [R0402]  40.79 81.61 90 top
R71  -  [R0402]  37.84 95.63 90 top
R71#2  -  [R0402]  37.79 92.15 90 top
R71#3  -  [R0402]  37.79 88.57 90 top
R71#4  -  [R0402]  37.79 84.76 90 top
R71#5  -  [R0402]  37.79 81.61 90 top
R72  -  [R0402]  34.84 95.63 90 top
R72#2  -  [R0402]  34.78 92.15 90 top
R72#3  -  [R0402]  34.78 88.57 90 top
R72#4  -  [R0402]  34.78 84.76 90 top
R72#5  -  [R0402]  34.78 81.61 90 top
R73  -  [R0402]  31.83 95.63 90 top
R73#2  -  [R0402]  31.78 92.15 90 top
R73#3  -  [R0402]  31.78 88.57 90 top
R73#4  -  [R0402]  31.78 84.76 90 top
R73#5  -  [R0402]  31.78 81.61 90 top
R74  -  [R0402]  1.82 95.63 90 top
R74#2  -  [R0402]  1.77 92.15 90 top
R74#3  -  [R0402]  1.77 88.57 90 top
R74#4  -  [R0402]  1.77 84.76 90 top
R74#5  -  [R0402]  1.77 81.61 90 top
R75  -  [R0402]  4.82 95.63 90 top
R75#2  -  [R0402]  4.77 92.15 90 top
R75#3  -  [R0402]  4.77 88.57 90 top
R75#4  -  [R0402]  4.77 84.76 90 top
R75#5  -  [R0402]  4.77 81.61 90 top
R76  -  [R0402]  10.83 95.63 90 top
R76#2  -  [R0402]  10.78 92.15 90 top
R76#3  -  [R0402]  10.78 88.57 90 top
R76#4  -  [R0402]  10.78 84.76 90 top
R76#5  -  [R0402]  10.78 81.61 90 top
R77  -  [R0402]  13.83 95.63 90 top
R77#2  -  [R0402]  13.78 92.15 90 top
R77#3  -  [R0402]  13.78 88.57 90 top
R77#4  -  [R0402]  13.78 84.76 90 top
R77#5  -  [R0402]  13.78 81.61 90 top
R78  -  [R0402]  28.83 95.63 90 top
R78#2  -  [R0402]  28.78 92.15 90 top
R78#3  -  [R0402]  28.78 88.57 90 top
R78#4  -  [R0402]  28.78 84.76 90 top
R78#5  -  [R0402]  28.78 81.61 90 top
R79  -  [R0402]  58.84 95.63 90 top
R79#2  -  [R0402]  58.79 92.13 90 top
R79#3  -  [R0402]  58.79 88.62 90 top
R79#4  -  [R0402]  58.79 85.12 90 top
R79#5  -  [R0402]  58.79 81.61 90 top
R80  -  [R0402]  25.83 95.63 90 top
R80#2  -  [R0402]  25.78 92.15 90 top
R80#3  -  [R0402]  25.78 88.57 90 top
R80#4  -  [R0402]  25.78 84.76 90 top
R80#5  -  [R0402]  25.78 81.61 90 top
R81  -  [R0402]  22.83 95.63 90 top
R81#2  -  [R0402]  22.78 92.15 90 top
R81#3  -  [R0402]  22.78 88.57 90 top
R81#4  -  [R0402]  22.78 84.76 90 top
R81#5  -  [R0402]  22.78 81.61 90 top
R82  -  [R0402]  55.84 95.63 90 top
R82#2  -  [R0402]  55.79 92.15 90 top
R82#3  -  [R0402]  55.79 88.57 90 top
R82#4  -  [R0402]  55.79 84.76 90 top
R82#5  -  [R0402]  55.79 81.61 90 top
R83  -  [R0402]  19.83 95.63 90 top
R83#2  -  [R0402]  19.78 92.15 90 top
R83#3  -  [R0402]  19.78 88.57 90 top
R83#4  -  [R0402]  19.78 84.76 90 top
R83#5  -  [R0402]  19.78 81.61 90 top
R84  -  [R0402]  16.83 95.63 90 top
R84#2  -  [R0402]  16.78 92.15 90 top
R84#3  -  [R0402]  16.78 88.57 90 top
R84#4  -  [R0402]  16.78 84.76 90 top
R84#5  -  [R0402]  16.78 81.61 90 top
R85  -  [R0402]  7.83 95.63 90 top
R85#2  -  [R0402]  7.77 92.15 90 top
R85#3  -  [R0402]  7.77 88.57 90 top
R85#4  -  [R0402]  7.77 84.76 90 top
R85#5  -  [R0402]  7.77 81.61 90 top
R86  -  [R0805]  15.4 72.49 90 top
R86#2  -  [R0805]  63.68 72.49 90 top
R86#3  -  [R0805]  63.55 77.53 90 top
R86#4  -  [R0805]  15.27 77.53 90 top
R87  -  [R0805]  29.19 72.49 90 top
R87#2  -  [R0805]  77.48 72.49 90 top
R87#3  -  [R0805]  29.06 77.53 90 top
R87#4  -  [R0805]  77.35 77.53 90 top
R88  -  [R0805]  49.89 72.49 90 top
R88#2  -  [R0805]  98.17 72.49 90 top
R88#3  -  [R0805]  98.04 77.53 90 top
R88#4  -  [R0805]  49.76 77.53 90 top
R89  -  [R0805]  46.44 72.49 90 top
R89#2  -  [R0805]  94.72 72.49 90 top
R89#3  -  [R0805]  94.59 77.53 90 top
R89#4  -  [R0805]  46.31 77.53 90 top
R90  -  [R0805]  56.78 72.49 90 top
R90#2  -  [R0805]  5.05 72.49 90 top
R90#3  -  [R0805]  56.66 77.53 90 top
R90#4  -  [R0805]  4.92 77.53 90 top
R91  -  [R0805]  53.33 72.49 90 top
R91#2  -  [R0805]  1.6 72.49 90 top
R91#3  -  [R0805]  1.47 77.53 90 top
R91#4  -  [R0805]  53.21 77.53 90 top
R92  -  [R0805]  39.54 72.49 90 top
R92#2  -  [R0805]  87.82 72.49 90 top
R92#3  -  [R0805]  39.41 77.53 90 top
R92#4  -  [R0805]  87.7 77.53 90 top
R93  -  [R0805]  42.99 72.49 90 top
R93#2  -  [R0805]  91.27 72.49 90 top
R93#3  -  [R0805]  42.86 77.53 90 top
R93#4  -  [R0805]  91.15 77.53 90 top
R94  -  [R0805]  36.09 72.49 90 top
R94#2  -  [R0805]  84.37 72.49 90 top
R94#3  -  [R0805]  35.96 77.53 90 top
R94#4  -  [R0805]  84.25 77.53 90 top
R95  -  [R0805]  32.64 72.49 90 top
R95#2  -  [R0805]  80.93 72.49 90 top
R95#3  -  [R0805]  80.8 77.53 90 top
R95#4  -  [R0805]  32.51 77.53 90 top
R96  -  [R0805]  8.5 72.49 90 top
R96#2  -  [R0805]  8.37 77.53 90 top
R97  -  [R0805]  11.95 72.49 90 top
R97#2  -  [R0805]  60.23 72.49 90 top
R97#3  -  [R0805]  60.11 77.53 90 top
R97#4  -  [R0805]  11.82 77.53 90 top
R98  -  [R0805]  18.84 72.49 90 top
R98#2  -  [R0805]  67.13 72.49 90 top
R98#3  -  [R0805]  67 77.53 90 top
R98#4  -  [R0805]  18.72 77.53 90 top
R99  -  [R0805]  22.29 72.49 90 top
R99#2  -  [R0805]  70.58 72.49 90 top
R99#3  -  [R0805]  70.45 77.53 90 top
R99#4  -  [R0805]  22.17 77.53 90 top
R106  -  [R0603]  80.65 23.81 90 top
R106#2  -  [R0603]  80.65 32.72 90 top
R106#3  -  [R0603]  80.65 42.03 90 top
R106#4  -  [R0603]  80.65 50.89 90 top
R106#5  -  [R0603]  80.65 6.6 90 top
R106#6  -  [R0603]  80.65 58.87 90 top
R106#7  -  [R0603]  80.65 67.27 90 top
R106#8  -  [R0603]  80.65 14.8 90 top
